# EAGLE design Qwiic_pHat_for_Raspberry_Pi_v20 (EAGLE 9.2.1)
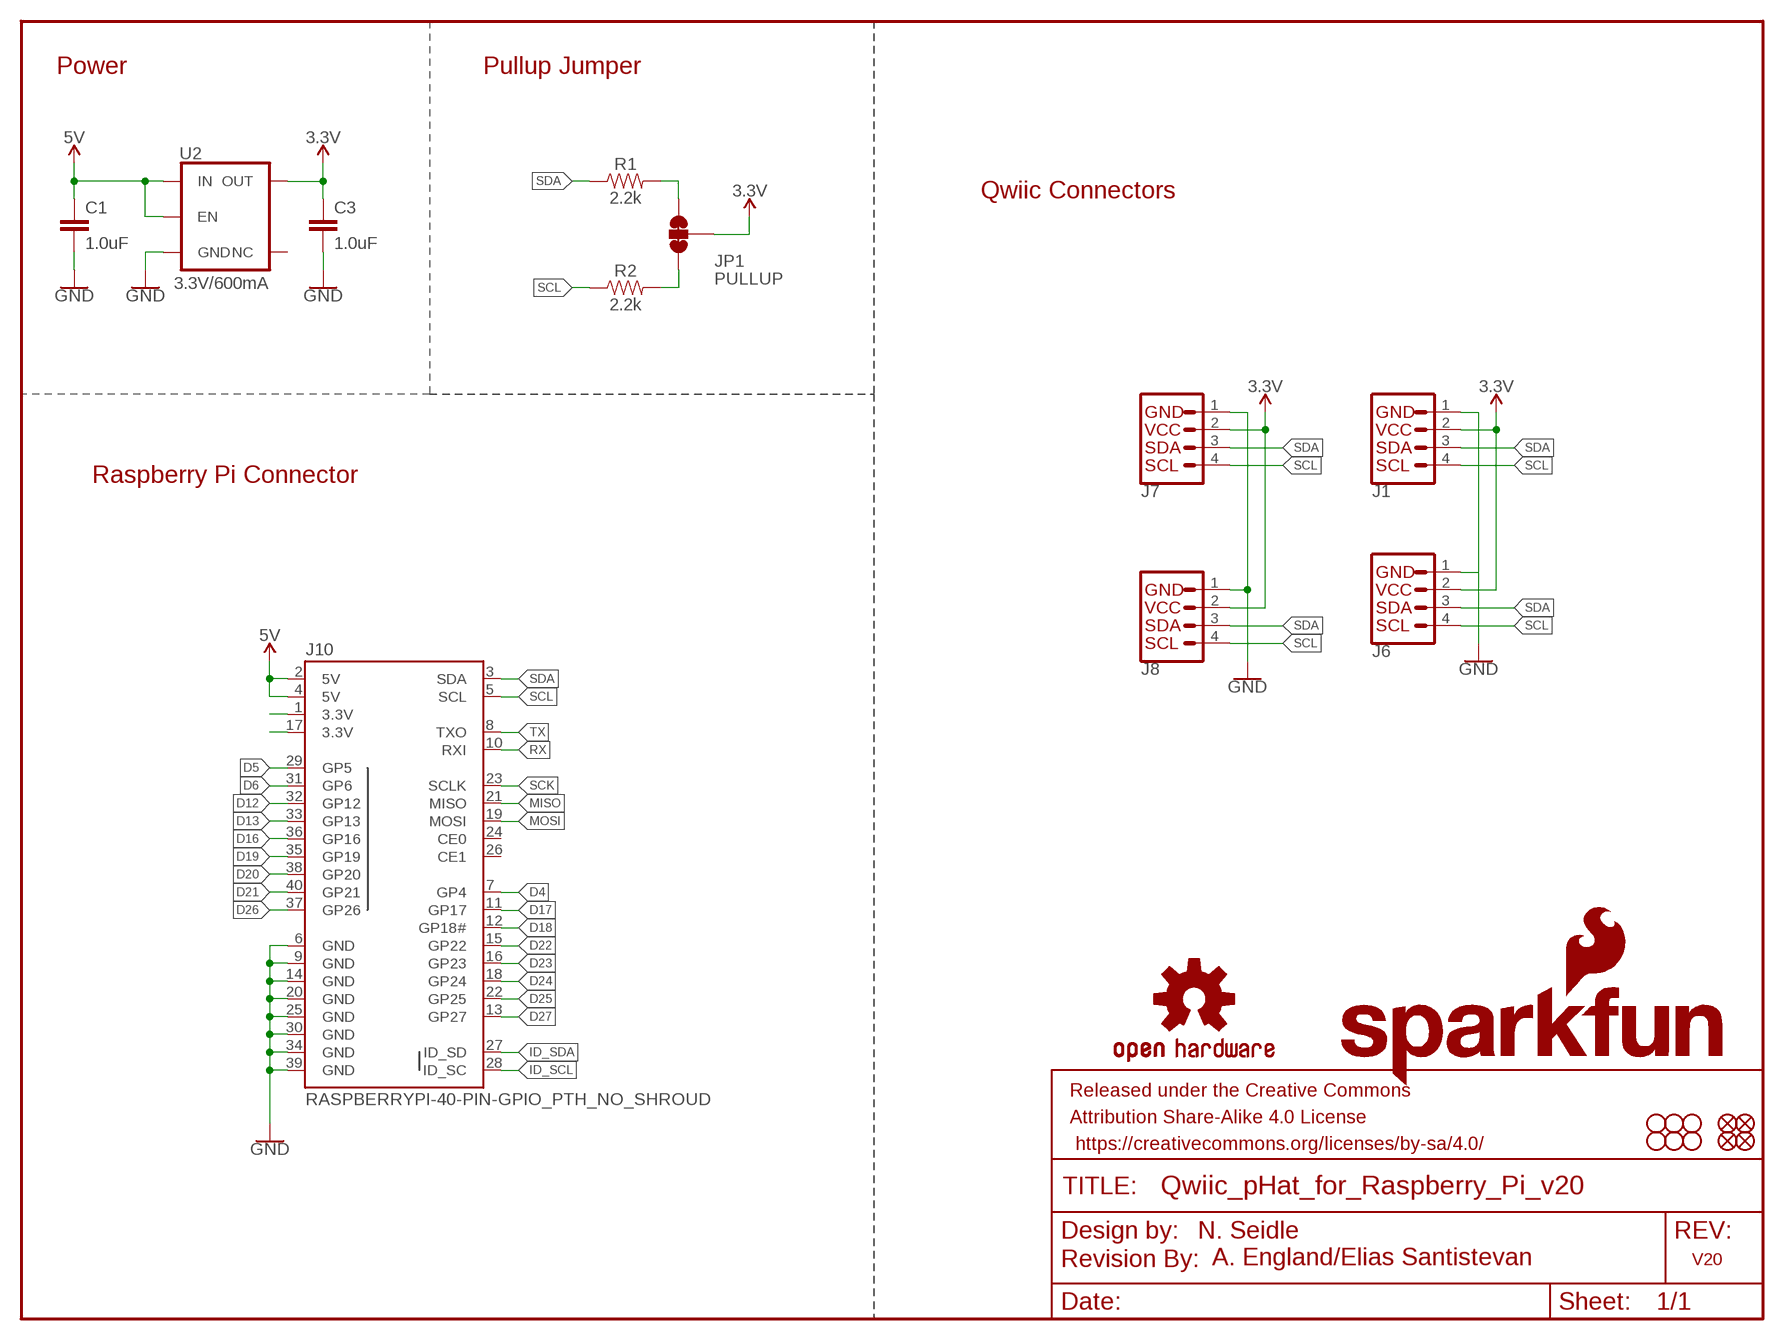
[diagram p0: schematic, sheet 1]

## Parts
C1  1.0uF  1.0UF-0603-16V-10%  [0603]
C3  1.0uF  1.0UF-0603-16V-10%  [0603]
FD1  FIDUCIAL1X2  [FIDUCIAL-1X2]
FD2  FIDUCIAL1X2  [FIDUCIAL-1X2]
FD3  FIDUCIAL1X2  [FIDUCIAL-1X2]
FD4  FIDUCIAL1X2  [FIDUCIAL-1X2]
FRAME1  FRAME-LETTER  [CREATIVE_COMMONS]
H1  STAND-OFFTIGHT  [STAND-OFF-TIGHT]
H2  STAND-OFFTIGHT  [STAND-OFF-TIGHT]
H3  STAND-OFFTIGHT  [STAND-OFF-TIGHT]
H4  STAND-OFFTIGHT  [STAND-OFF-TIGHT]
H5  STAND-OFFTIGHT  [STAND-OFF-TIGHT]
H6  STAND-OFFTIGHT  [STAND-OFF-TIGHT]
J1  Qwiic Right Angle  I2C_STANDARDQWIIC  [JST04_1MM_RA]
J6  Qwiic Right Angle  I2C_STANDARDQWIIC  [JST04_1MM_RA]
J7  Qwiic Right Angle  I2C_STANDARDQWIIC  [JST04_1MM_RA]
J8  Qwiic Right Angle  I2C_STANDARDQWIIC  [JST04_1MM_RA]
J10  RASPBERRYPI-40-PIN-GPIO_PTH_NO_SHROUD  [2X20]
JP1  PULLUP  JUMPER-SMT_3_2-NC_TRACE_NO-SILK  [SMT-JUMPER_3_2-NC_TRACE_NO-SILK]
LOGO1  SFE_LOGO_NAME_FLAME.2_INCH  [SFE_LOGO_NAME_FLAME_.2]
LOGO2  REVISION  [REVISION]
LOGO3  OSHW-LOGOS  [OSHW-LOGO-S]
R1  2.2k  2.2KOHM-0603-1/10W-1%  [0603]
R2  2.2k  2.2KOHM-0603-1/10W-1%  [0603]
U2  3.3V/600mA  V_REG_AP2112K-3.3V  [SOT23-5]

## Nets
3.3V: C3.1 J1.2 J6.2 J7.2 J8.2 JP1.2 U2.5(OUT)
5V: C1.1 J10.2(5V) J10.4(5V) U2.1(IN) U2.3(EN)
D4: J10.7(GP4)
D5: J10.29(GP5)
D6: J10.31(GP6)
D12: J10.32(GP12)
D13: J10.33(GP13)
D16: J10.36(GP16)
D17: J10.11(GP17)
D18: J10.12(GP18#)
D19: J10.35(GP19)
D20: J10.38(GP20)
D21: J10.40(GP21)
D22: J10.15(GP22)
D23: J10.16(GP23)
D24: J10.18(GP24)
D25: J10.22(GP25)
D26: J10.37(GP26)
D27: J10.13(GP27)
GND [vcc]: C1.2 C3.2 J1.1 J6.1 J7.1 J8.1 J10.6(GND) J10.9(GND) J10.14(GND) J10.20(GND) J10.25(GND) J10.30(GND) J10.34(GND) J10.39(GND) U2.2(GND)
ID_SCL: J10.28(ID_SC)
ID_SDA: J10.27(ID_SD)
MISO: J10.21(MISO)
MOSI: J10.19(MOSI)
N$1: J10.17(3.3V)
N$2: J10.1(3.3V)
N$3: JP1.3 R1.2
N$4: JP1.1 R2.2
RX: J10.10(RXI)
SCK: J10.23(SCLK)
SCL: J1.4 J6.4 J7.4 J8.4 J10.5(SCL) R2.1
SDA: J1.3 J6.3 J7.3 J8.3 J10.3(SDA) R1.1
TX: J10.8(TXO)
Unconnected: J10.24(CE0) J10.26(CE1) U2.4(NC)

## Notes on the sheet
- Power | Pullup Jumper
- Qwiic Connectors
- Raspberry Pi Connector
- N. Seidle
- A. England/Elias Santistevan | V20

## Library data of the parts
C1 C3 = SparkFun-Capacitors:1.0UF: 1µF ceramic capacitors A capacitor is a passive two-terminal electrical component used to store electrical energy temporarily in an electric field.; PROD_ID: CAP-00868
FD1-FD4 = SparkFun-Aesthetics:FIDUCIAL: Fiducial Alignment Points Point-of-reference for pick-and-place machines and other optical instruments.
FRAME1 = SparkFun-Aesthetics:FRAME-LETTER: Schematic Frame - Letter Standard 8.5x11 US Letter frame
H1-H6 = SparkFun-Hardware:STAND-OFF: Stand Off Drill holes for mechanically mounting via screws, standoffs, etc. Note: Use the keepout ring to avoid running the screw head into surrounding components. Variant Overviews STAND-OFF - Mechanical footprint for a #4 phillips button head screw. STAND-OFF-TIGHT - Mechanical footprint for a #4 phillips button head screw, Example SparkFun Products Screw - Phillips Head (1/4", 4-40, 10 pack) <https://www.sparkfun.com/products/10453> (PRT-10453) Screw - Phillips Head (1/2", 4-40, 10 pack) <https://www.sparkfun.com/products/10452> (PRT-10452) Screw - Phillips Head (3/4", 4-40, 10 pack) <https://www.sparkfun.com/products/10451> (PRT-10451) Screw - Phillips Head (1", 4-40, 10 pack) <https://www.sparkfun.com/products/10450> (PRT-10450)
J1 J6-J8 = SparkFun-Connectors:I2C_STANDARD: SparkFun I2C Standard Pinout Header SparkFun has standardized on a pinout for all I2C based sensor breakouts. This pinout allows I2C boards to be plugged directly into the headers on Arduino Uno compatible boards, and to be daisy chained easily. Example SparkFun Products: SparkFun Atmospheric Sensor Breakout - BME280 <https://www.sparkfun.com/products/13676> SparkFun Altitude/Pressure Sensor Breakout - MPL3115A2 <https://www.sparkfun.com/products/11084> SparkFun TOF Range Finder Sensor - VL6180 <https://www.sparkfun.com/products/12785>; PROD_ID: CONN-13694
J10 = SparkFun-Connectors:RASPBERRYPI-40-PIN-GPIO: Raspberry Pi GPIO Header 2x20 pin connector, as found on B, B+, A+ models. Both shrouded PTH and SMT versions available. SparkFun Products: GPIO Shrouded Header <https://www.sparkfun.com/products/13054>- PTH SparkFun Pi Wedge (Preassembled) <https://www.sparkfun.com/products/13717>
JP1 = SparkFun-Jumpers:JUMPER-SMT_3_2-NC_TRACE: Normally closed trace jumper (2 of 2 connections) This jumper has a trace between all three pads so they are normally closed (NC). Use a razor knife to open the connection(s). For best results follow the IPC guidelines for cutting traces: Cutout at least 0.063 mm (0.005 in). Remove all loose material to clean up the cut area. Seal the cut with an approved epoxy. Reapply solder to reclose the connection(s).
LOGO1 = SparkFun-Aesthetics:SFE_LOGO_NAME_FLAME: SparkFun Font Logo w/ Flame This is the SparkFun full logo. The logo on the schematic will always be the same size; the package variant is the height of the flame part of the logo. Default layer for the logo on the board is tSilk.
LOGO2 = SparkFun-Aesthetics:REVISION: "Revision By" Text Preceding text for revisor documentation. Includes schematic text on "symbols" layer, and board text on tDoc.
LOGO3 = SparkFun-Aesthetics:OSHW-LOGO: Open-Source Hardware (OSHW) Logo This logo indicates the piece of hardware it is found on incorporates a OSHW license and/or adheres to the definition of open source hardware found here: http://freedomdefined.org/OSHW
R1 R2 = SparkFun-Resistors:2.2KOHM: 2.2kΩ resistor A resistor is a passive two-terminal electrical component that implements electrical resistance as a circuit element. Resistors act to reduce current flow, and, at the same time, act to lower voltage levels within circuits. - Wikipedia; PROD_ID: RES-08272
U2 = SparkFun-IC-Power:V_REG_AP2112: AP2112 - 600mA CMOS LDO Regulator w/ Enable The AP2112 is CMOS process low dropout linear regulator with enable function, the regulator delivers a guaranteed 600mA (min.) continuous load current. Features Output Voltage Accuracy: ±1.5% Output Current: 600mA (Min.) Foldback Short Current Protection: 50mA Enable Function to Turn ON/OFF VOUT Low Dropout Voltage (3.3V): 250mV (Typ.) @IOUT=600mA Excellent Load Regulation: 0.2%/A (Typ.) Excellent Line Regulation: 0.02%/V (Typ.) Low Quiescent Current: 55μA (Typ.) Low Standby Current: 0.01μA (Typ.) Low Output Noise: 50μVRMS PSRR: 100Hz -65dB, 1kHz -65dB OTSD Protection Stable with 1.0μF Flexible Cap: Ceramic, Tantalum and Aluminum Electrolytic Operation Temperature Range: -40°C to 85°C ESD: MM 400V, HBM 4000V; PROD_ID: VREG-12457; VALUE: 3.3V

## Net classes
0 Default: width 0.178 mm
1 vcc: width 0.178 mm

## Board
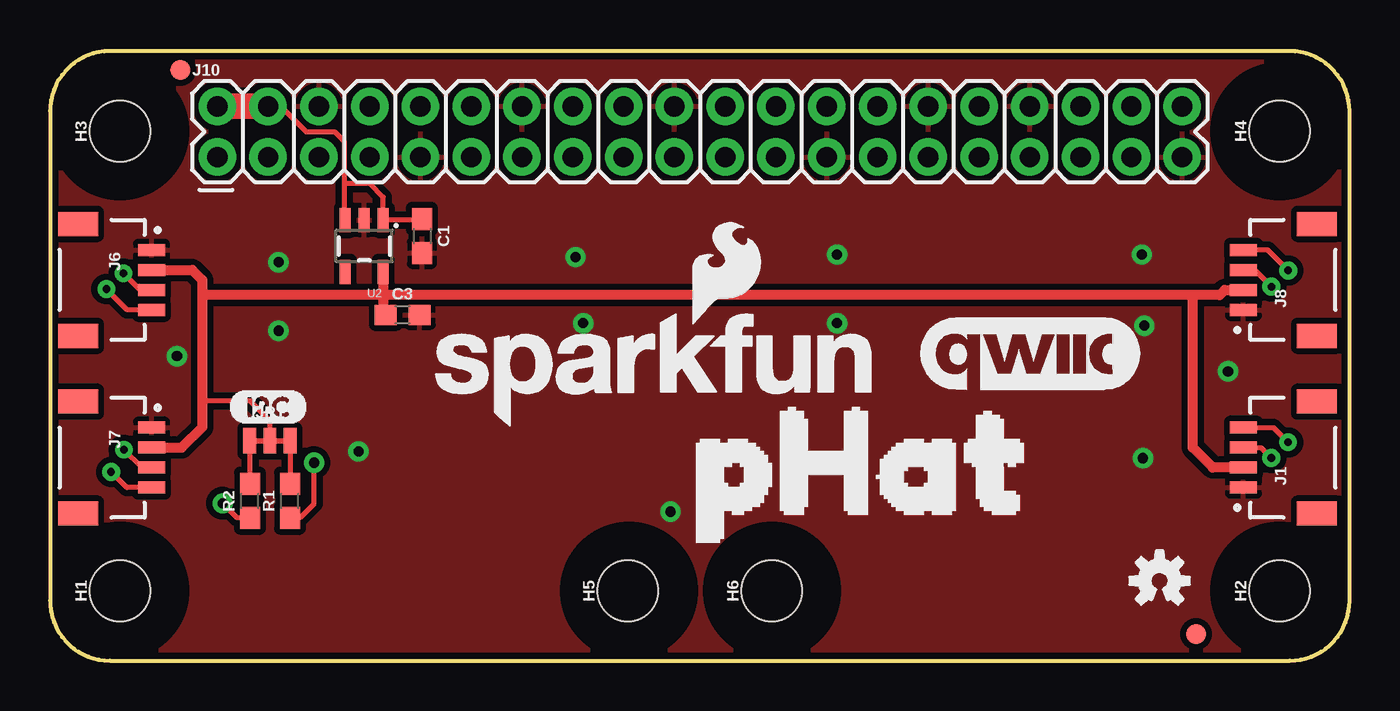
[diagram p1: board, top side]
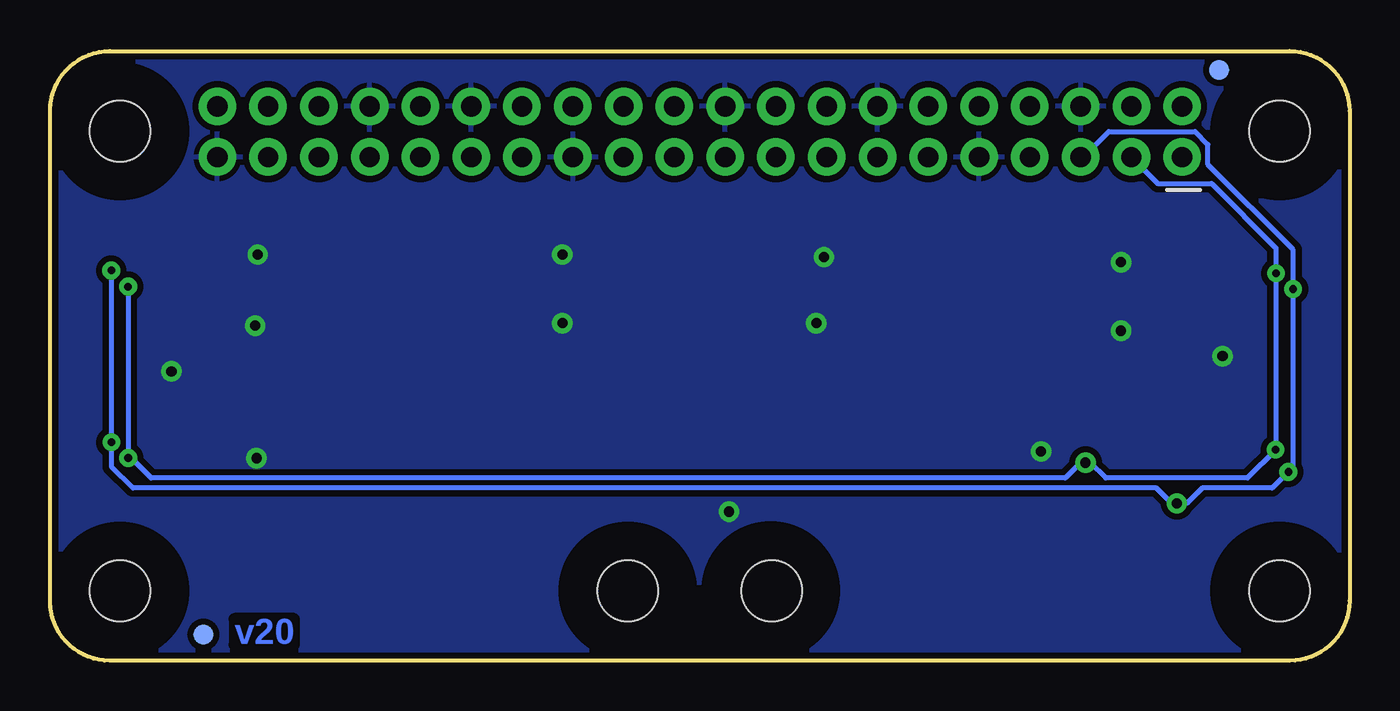
[diagram p2: board, bottom side, seen from below]

Size 65 x 30.5 mm. Coordinates in mm from the lower left corner, seen from the top.
Outline: 3,0 62,0 arc90 65,3 65,27.5 arc90 62,30.5 3,30.5 arc90 0,27.5 0,3 arc90 3,0
Copper layers (1*16): Top 0.035mm / dielectric 1.5mm / Bottom 0.035mm
Design rules "SparkFun-2-layer-STANDARD": minimum track width 10mil, minimum drill 20mil, track to track 10mil, track to pad 8mil, pad to pad 8mil, via to via 10mil, smd to smd 8mil, copper to edge 8mil, drill to drill 8mil, minimum pad ring 10mil, minimum via ring 10mil, stop-mask expansion 4mil, vias tented up to drill 25mil, thermal gap 10mil
tRestrict: area 0.4,0.4 to 6.7,6.7; area 58.4,0.4 to 64.7,6.7; area 58.4,23.4 to 64.7,29.6; area 0.4,23.4 to 6.7,29.6; area 33,0.3 to 39.3,6.6; area 25.8,0.4 to 32.1,6.7
bRestrict: area 58.4,0.4 to 64.7,6.7; area 0.4,0.4 to 6.7,6.7; area 0.4,23.4 to 6.7,29.6; area 58.4,23.4 to 64.7,29.6; area 33,0.3 to 39.2,6.6; area 25.8,0.4 to 32.1,6.7

### Footprints (pad centres in the part's own frame; a part is rotated, then mirrored left to right if it is on the bottom)
0603 = smd 1.1 x 1: 1 -0.85,0; 2 0.85,0
FIDUCIAL-1X2 = smd 1 x 1: 1 0,0
STAND-OFF-TIGHT = hole 3.048: 0,0
JST04_1MM_RA = smd 0.6 x 1.35: 1 -1.5,0; 2 -0.5,0; 3 0.5,0; 4 1.5,0 | smd 1.2 x 2: NC1 2.8,-3.675; NC2 -2.8,-3.675
2X20 = drill 1.016 pad 1.88: 1 0,0; 2 0,2.54; 3 2.54,0; 4 2.54,2.54; 5 5.08,0; 6 5.08,2.54; 7 7.62,0; 8 7.62,2.54; 9 10.16,0; 10 10.16,2.54; 11 12.7,0; 12 12.7,2.54; 13 15.24,0; 14 15.24,2.54; 15 17.78,0; 16 17.78,2.54; 17 20.32,0; 18 20.32,2.54; 19 22.86,0; 20 22.86,2.54; 21 25.4,0; 22 25.4,2.54; 23 27.94,0; 24 27.94,2.54; 25 30.48,0; 26 30.48,2.54; 27 33.02,0; 28 33.02,2.54; 29 35.56,0; 30 35.56,2.54; 31 38.1,0; 32 38.1,2.54; 33 40.64,0; 34 40.64,2.54; 35 43.18,0; 36 43.18,2.54; 37 45.72,0; 38 45.72,2.54; 39 48.26,0; 40 48.26,2.54
SMT-JUMPER_3_2-NC_TRACE_NO-SILK = smd 0.635 x 1.27: 1 -1.016,0; 2 0,0; 3 1.016,0
SOT23-5 = smd 0.55 x 1.2: 1 -0.95,-1.3; 2 0,-1.3; 3 0.95,-1.3; 4 0.95,1.3; 5 -0.95,1.3

### Placement (x,y rotation side)
C1  18.61,21.25 270 top
C3  17.64,17.3 0 top
FD1  6.52,29.56 180 top
FD2  57.33,1.34 180 top
FD3  57.33,1.31 0 bottom
FD4  6.52,29.56 0 bottom
FRAME1  -8.89,-24.13 0 top  (outside the outline)
H1  3.5,3.5 90 top
H2  61.5,3.5 90 top
H3  3.5,26.5 90 top
H4  61.5,26.5 90 top
H5  28.9,3.5 90 top
H6  36.1,3.5 90 top
J1  59.69,10.16 90 top
J6  5.08,19.05 270 top
J7  5.08,10.16 270 top
J8  59.69,19.05 90 top
J10  8.37,25.2 0 top
JP1  11,11 0 top
LOGO1  30.27,14.57 0 top
LOGO2  2.54,-26.67 0 top  (outside the outline)
LOGO3  55.5,4 0 top
R1  12,8 90 top
R2  10,8 90 top
U2  15.72,20.75 180 top
U$1  [QWIIC_11MM]  49.05,15.32 0 top
U$2  [I2C-()]  8.89,12.7 0 top
U$3  [PHAT0]  27.5,10 0 top

### Tracks (layer width: path | path; a pad name or v marks a point on that pad's centre or on a via)
3.3V
  Top 0.254: 16.67,17.42 C3.1 | JP1.2 11,12 10,13 7.62,13
  Top 0.508: U2.5 16.67,18.3 | 16.67,18.3 16.67,18.29 | 16.67,18.29 16.67,17.42 | 57.15,18.3 58.5,18.3 58.75,18.55 J8.2 | 57.15,18.3 16.68,18.3 16.67,18.29 | J1.2 58.16,9.66 57.15,10.67 57.15,18.3 | J7.2 6.6,10.66 7.62,11.68 7.62,13 7.62,18.3 | J6.2 7.12,19.55 7.62,19.05 7.62,18.3 | 16.67,18.3 7.62,18.3
5V
  Top 0.254: J10.4 11.53,27.74 12.8,26.47 14.24,26.47 14.72,25.99 14.72,23.88 | 14.72,23.88 16,23.88 16.67,23.21 U2.1 18.56,22.05 C1.1 | 14.72,23.88 14.72,22.1 U2.3
  Top 1.27: J10.2 J10.4
GND  (via drill 0.51)
  other vias: 6.35,15.24 11.43,16.51 54.61,20.32 58.93,14.48 54.74,16.76 11.43,19.94 26.29,20.19 26.67,16.89 39.37,16.89 39.37,20.32 15.43,10.47 31.03,7.46 54.67,10.14
  pour Top (isolate 0.305): 0,30.61 65.02,30.61 65.02,0 0,0
  pour Bottom (isolate 0.305): 0,30.61 65.02,30.61 65.02,0 0,0
N$3
  Top 0.254: JP1.3 12.02,8.87 R1.2
N$4
  Top 0.254: 9.91,8.94 R2.2 10,10.98 JP1.1
SCL  (via drill 0.38, 0.51)
  Top 0.254: J1.4 61.2,11.66 v61.93,10.93 | v61.93,19.52 60.91,20.55 J8.4 | J6.4 3.87,17.55 v2.82,18.59 | J7.4 3.84,8.66 v3.06,9.45 | R2.1 9.36,7.15 v8.64,7.87
  Bottom 0.254: v61.93,19.52 v61.93,10.93 61.93,9.71 60.86,8.64 9.65,8.64 8.89,7.87 v8.64,7.87 8.13,7.87 7.37,8.64 3.87,8.64 v3.06,9.45 2.84,9.66 2.84,18.57 v2.82,18.59 2.82,20.57 7.08,24.82 7.08,25.83 7.72,26.48 12.05,26.48 13.33,25.2 J10.5
SDA  (via drill 0.38, 0.51)
  Top 0.254: J1.3 60.57,10.66 v61.09,10.15 | v61.09,18.71 60.26,19.55 J8.3 | J7.3 4.59,9.66 v3.69,10.56 | v3.67,19.38 4.5,18.55 J6.3 | R1.1 12.51,7.15 13.21,7.85 v13.21,9.91
  Bottom 0.254: v61.09,18.71 v61.09,10.15 60.95,10.15 59.94,9.14 14.22,9.14 13.46,9.91 v13.21,9.91 12.95,9.91 12.19,9.14 5.11,9.14 v3.69,10.56 3.69,19.36 v3.67,19.38 3.67,20.66 6.9,23.88 9.59,23.88 J10.3

### Text on the board
Bottom: v20
Measures: Units in MM
tDocu: N. Seidle | A. England and Elias Santistevan